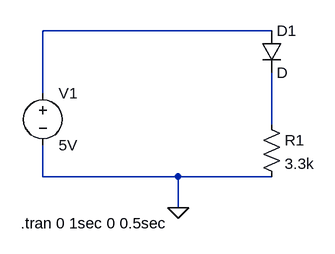
[diagram p0: schematic Draft2.asc]
Draft2.asc, the LTspice schematic file:
Version 4
SHEET 1 880 680
WIRE 288 16 -64 16
WIRE -64 112 -64 16
WIRE 288 160 288 80
WIRE -64 240 -64 192
WIRE 144 240 -64 240
WIRE 288 240 144 240
WIRE 144 288 144 240
FLAG 144 288 0
SYMBOL diode 272 16 R0
SYMATTR InstName D1
SYMBOL res 272 144 R0
SYMATTR InstName R1
SYMATTR Value 3.3k
SYMBOL voltage -64 96 R0
SYMATTR InstName V1
SYMATTR Value 5V
TEXT -98 312 Left 2 !.tran 0 1sec 0 0.5sec

The netlist it stands for:
* Draft2.asc
D1 N001 N002 D
R1 N002 0 3.3k
V1 N001 0 5V
.model D D
.lib standard.dio
.tran 0 1sec 0 0.5sec
.backanno
.end